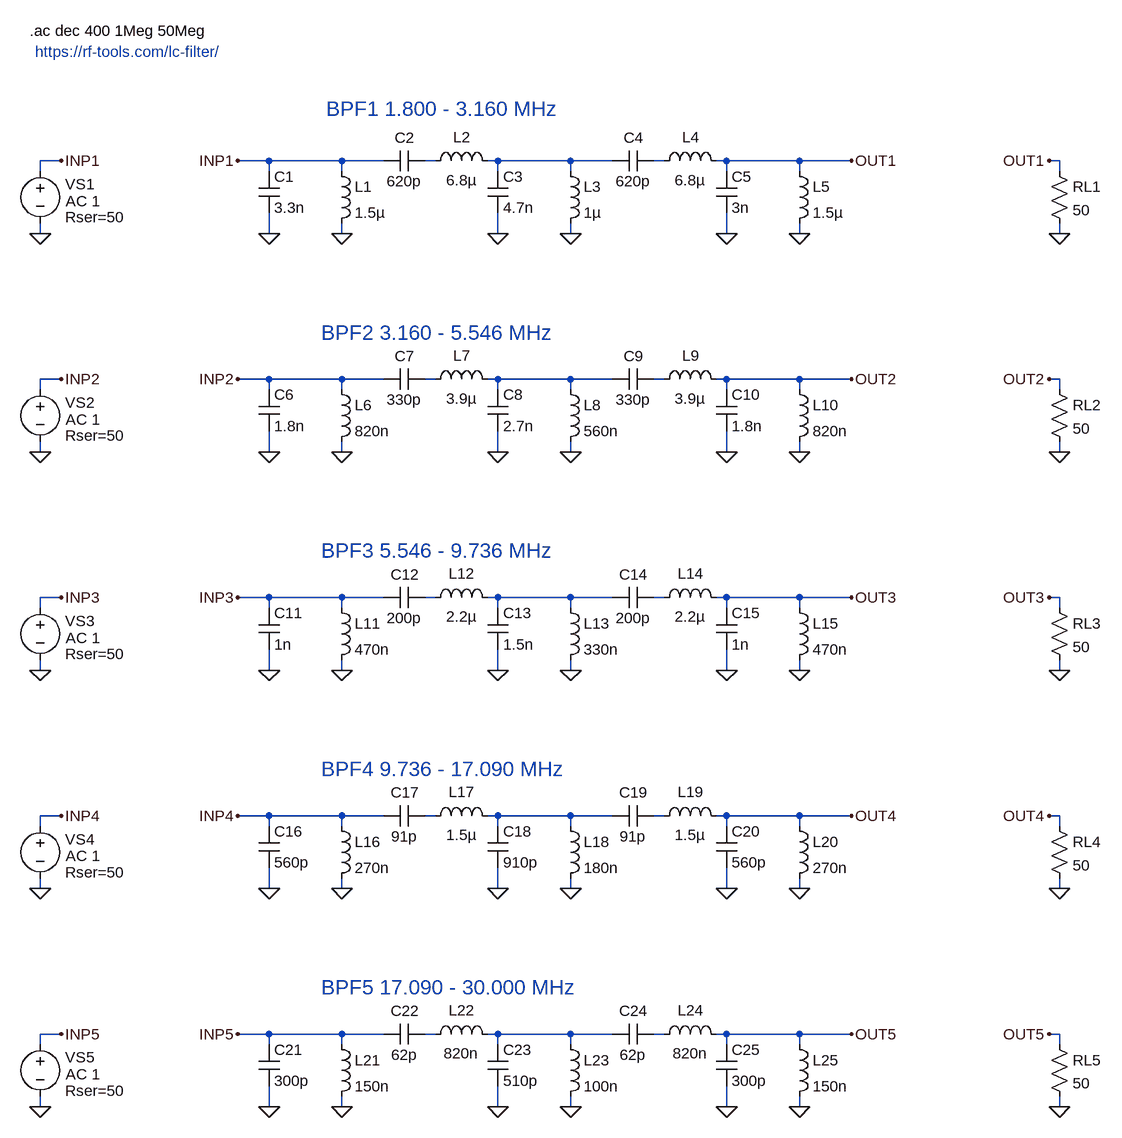
[diagram p0: schematic BPF.asc]
BPF.asc, the LTspice schematic file:
Version 4
SHEET 1 2944 2596
WIRE 16 112 -16 112
WIRE 336 112 288 112
WIRE 448 112 336 112
WIRE 512 112 448 112
WIRE 592 112 576 112
WIRE 688 112 672 112
WIRE 800 112 688 112
WIRE 864 112 800 112
WIRE 944 112 928 112
WIRE 1040 112 1024 112
WIRE 1152 112 1040 112
WIRE 1232 112 1152 112
WIRE 1552 112 1536 112
WIRE -16 128 -16 112
WIRE 336 128 336 112
WIRE 448 128 448 112
WIRE 688 128 688 112
WIRE 800 128 800 112
WIRE 1040 128 1040 112
WIRE 1152 128 1152 112
WIRE 1552 128 1552 112
WIRE -16 224 -16 208
WIRE 336 224 336 192
WIRE 448 224 448 208
WIRE 688 224 688 192
WIRE 800 224 800 208
WIRE 1040 224 1040 192
WIRE 1152 224 1152 208
WIRE 1552 224 1552 208
WIRE 16 448 -16 448
WIRE 336 448 288 448
WIRE 448 448 336 448
WIRE 512 448 448 448
WIRE 592 448 576 448
WIRE 688 448 672 448
WIRE 800 448 688 448
WIRE 864 448 800 448
WIRE 944 448 928 448
WIRE 1040 448 1024 448
WIRE 1152 448 1040 448
WIRE 1232 448 1152 448
WIRE 1552 448 1536 448
WIRE -16 464 -16 448
WIRE 336 464 336 448
WIRE 448 464 448 448
WIRE 688 464 688 448
WIRE 800 464 800 448
WIRE 1040 464 1040 448
WIRE 1152 464 1152 448
WIRE 1552 464 1552 448
WIRE -16 560 -16 544
WIRE 336 560 336 528
WIRE 448 560 448 544
WIRE 688 560 688 528
WIRE 800 560 800 544
WIRE 1040 560 1040 528
WIRE 1152 560 1152 544
WIRE 1552 560 1552 544
WIRE 16 784 -16 784
WIRE 336 784 288 784
WIRE 448 784 336 784
WIRE 512 784 448 784
WIRE 592 784 576 784
WIRE 688 784 672 784
WIRE 800 784 688 784
WIRE 864 784 800 784
WIRE 944 784 928 784
WIRE 1040 784 1024 784
WIRE 1152 784 1040 784
WIRE 1232 784 1152 784
WIRE 1552 784 1536 784
WIRE -16 800 -16 784
WIRE 336 800 336 784
WIRE 448 800 448 784
WIRE 688 800 688 784
WIRE 800 800 800 784
WIRE 1040 800 1040 784
WIRE 1152 800 1152 784
WIRE 1552 800 1552 784
WIRE -16 896 -16 880
WIRE 336 896 336 864
WIRE 448 896 448 880
WIRE 688 896 688 864
WIRE 800 896 800 880
WIRE 1040 896 1040 864
WIRE 1152 896 1152 880
WIRE 1552 896 1552 880
WIRE 16 1120 -16 1120
WIRE 336 1120 288 1120
WIRE 448 1120 336 1120
WIRE 512 1120 448 1120
WIRE 592 1120 576 1120
WIRE 688 1120 672 1120
WIRE 800 1120 688 1120
WIRE 864 1120 800 1120
WIRE 944 1120 928 1120
WIRE 1040 1120 1024 1120
WIRE 1152 1120 1040 1120
WIRE 1232 1120 1152 1120
WIRE 1552 1120 1536 1120
WIRE -16 1136 -16 1120
WIRE 336 1136 336 1120
WIRE 448 1136 448 1120
WIRE 688 1136 688 1120
WIRE 800 1136 800 1120
WIRE 1040 1136 1040 1120
WIRE 1152 1136 1152 1120
WIRE 1552 1136 1552 1120
WIRE -16 1232 -16 1216
WIRE 336 1232 336 1200
WIRE 448 1232 448 1216
WIRE 688 1232 688 1200
WIRE 800 1232 800 1216
WIRE 1040 1232 1040 1200
WIRE 1152 1232 1152 1216
WIRE 1552 1232 1552 1216
WIRE 16 1456 -16 1456
WIRE 336 1456 288 1456
WIRE 448 1456 336 1456
WIRE 512 1456 448 1456
WIRE 592 1456 576 1456
WIRE 688 1456 672 1456
WIRE 800 1456 688 1456
WIRE 864 1456 800 1456
WIRE 944 1456 928 1456
WIRE 1040 1456 1024 1456
WIRE 1152 1456 1040 1456
WIRE 1232 1456 1152 1456
WIRE 1552 1456 1536 1456
WIRE -16 1472 -16 1456
WIRE 336 1472 336 1456
WIRE 448 1472 448 1456
WIRE 688 1472 688 1456
WIRE 800 1472 800 1456
WIRE 1040 1472 1040 1456
WIRE 1152 1472 1152 1456
WIRE 1552 1472 1552 1456
WIRE -16 1568 -16 1552
WIRE 336 1568 336 1536
WIRE 448 1568 448 1552
WIRE 688 1568 688 1536
WIRE 800 1568 800 1552
WIRE 1040 1568 1040 1536
WIRE 1152 1568 1152 1552
WIRE 1552 1568 1552 1552
FLAG -16 224 0
FLAG 448 224 0
FLAG 336 224 0
FLAG 800 224 0
FLAG 688 224 0
FLAG 288 112 INP1
FLAG 16 112 INP1
FLAG 1552 224 0
FLAG 1536 112 OUT1
FLAG 1232 112 OUT1
FLAG -16 560 0
FLAG 288 448 INP2
FLAG 16 448 INP2
FLAG 1552 560 0
FLAG 1536 448 OUT2
FLAG -16 896 0
FLAG 288 784 INP3
FLAG 16 784 INP3
FLAG 1552 896 0
FLAG 1536 784 OUT3
FLAG -16 1232 0
FLAG 288 1120 INP4
FLAG 16 1120 INP4
FLAG 1552 1232 0
FLAG 1536 1120 OUT4
FLAG -16 1568 0
FLAG 288 1456 INP5
FLAG 16 1456 INP5
FLAG 1552 1568 0
FLAG 1536 1456 OUT5
FLAG 1152 224 0
FLAG 1040 224 0
FLAG 448 560 0
FLAG 336 560 0
FLAG 800 560 0
FLAG 688 560 0
FLAG 1232 448 OUT2
FLAG 1152 560 0
FLAG 1040 560 0
FLAG 448 896 0
FLAG 336 896 0
FLAG 800 896 0
FLAG 688 896 0
FLAG 1232 784 OUT3
FLAG 1152 896 0
FLAG 1040 896 0
FLAG 448 1232 0
FLAG 336 1232 0
FLAG 800 1232 0
FLAG 688 1232 0
FLAG 1232 1120 OUT4
FLAG 1152 1232 0
FLAG 1040 1232 0
FLAG 448 1568 0
FLAG 336 1568 0
FLAG 800 1568 0
FLAG 688 1568 0
FLAG 1232 1456 OUT5
FLAG 1152 1568 0
FLAG 1040 1568 0
SYMBOL voltage -16 112 R0
WINDOW 0 38 36 Left 2
WINDOW 123 39 62 Left 2
WINDOW 39 38 87 Left 2
SYMATTR InstName VS1
SYMATTR Value2 AC 1
SYMATTR SpiceLine Rser=50
SYMATTR Value ""
SYMBOL cap 320 128 R0
SYMATTR InstName C1
SYMATTR Value 3.3n
SYMBOL ind 432 112 R0
SYMATTR InstName L1
SYMATTR Value 1.5µ
SYMBOL cap 672 128 R0
SYMATTR InstName C3
SYMATTR Value 4.7n
SYMBOL ind 784 112 R0
SYMATTR InstName L3
SYMATTR Value 1µ
SYMBOL res 1536 112 R0
SYMATTR InstName RL1
SYMATTR Value 50
SYMBOL voltage -16 448 R0
WINDOW 0 38 36 Left 2
WINDOW 123 39 62 Left 2
WINDOW 39 38 87 Left 2
SYMATTR InstName VS2
SYMATTR Value2 AC 1
SYMATTR SpiceLine Rser=50
SYMATTR Value ""
SYMBOL res 1536 448 R0
SYMATTR InstName RL2
SYMATTR Value 50
SYMBOL voltage -16 784 R0
WINDOW 0 38 36 Left 2
WINDOW 123 39 62 Left 2
WINDOW 39 38 87 Left 2
SYMATTR InstName VS3
SYMATTR Value2 AC 1
SYMATTR SpiceLine Rser=50
SYMATTR Value ""
SYMBOL res 1536 784 R0
SYMATTR InstName RL3
SYMATTR Value 50
SYMBOL voltage -16 1120 R0
WINDOW 0 38 36 Left 2
WINDOW 123 39 62 Left 2
WINDOW 39 38 87 Left 2
SYMATTR InstName VS4
SYMATTR Value2 AC 1
SYMATTR SpiceLine Rser=50
SYMATTR Value ""
SYMBOL res 1536 1120 R0
SYMATTR InstName RL4
SYMATTR Value 50
SYMBOL voltage -16 1456 R0
WINDOW 0 38 36 Left 2
WINDOW 123 39 62 Left 2
WINDOW 39 38 87 Left 2
SYMATTR InstName VS5
SYMATTR Value2 AC 1
SYMATTR SpiceLine Rser=50
SYMATTR Value ""
SYMBOL res 1536 1456 R0
SYMATTR InstName RL5
SYMATTR Value 50
SYMBOL cap 928 96 R90
WINDOW 0 -4 31 VBottom 2
WINDOW 3 32 32 VTop 2
SYMATTR InstName C4
SYMATTR Value 620p
SYMBOL ind 928 128 R270
WINDOW 0 37 57 VTop 2
WINDOW 3 2 56 VBottom 2
SYMATTR InstName L4
SYMATTR Value 6.8µ
SYMBOL cap 576 96 R90
WINDOW 0 -4 31 VBottom 2
WINDOW 3 32 32 VTop 2
SYMATTR InstName C2
SYMATTR Value 620p
SYMBOL ind 576 128 R270
WINDOW 0 37 57 VTop 2
WINDOW 3 2 56 VBottom 2
SYMATTR InstName L2
SYMATTR Value 6.8µ
SYMBOL cap 1024 128 R0
SYMATTR InstName C5
SYMATTR Value 3n
SYMBOL ind 1136 112 R0
SYMATTR InstName L5
SYMATTR Value 1.5µ
SYMBOL cap 320 464 R0
SYMATTR InstName C6
SYMATTR Value 1.8n
SYMBOL ind 432 448 R0
SYMATTR InstName L6
SYMATTR Value 820n
SYMBOL cap 672 464 R0
SYMATTR InstName C8
SYMATTR Value 2.7n
SYMBOL ind 784 448 R0
SYMATTR InstName L8
SYMATTR Value 560n
SYMBOL cap 928 432 R90
WINDOW 0 -4 31 VBottom 2
WINDOW 3 32 32 VTop 2
SYMATTR InstName C9
SYMATTR Value 330p
SYMBOL ind 928 464 R270
WINDOW 0 37 57 VTop 2
WINDOW 3 2 56 VBottom 2
SYMATTR InstName L9
SYMATTR Value 3.9µ
SYMBOL cap 576 432 R90
WINDOW 0 -4 31 VBottom 2
WINDOW 3 32 32 VTop 2
SYMATTR InstName C7
SYMATTR Value 330p
SYMBOL ind 576 464 R270
WINDOW 0 37 57 VTop 2
WINDOW 3 2 56 VBottom 2
SYMATTR InstName L7
SYMATTR Value 3.9µ
SYMBOL cap 1024 464 R0
SYMATTR InstName C10
SYMATTR Value 1.8n
SYMBOL ind 1136 448 R0
SYMATTR InstName L10
SYMATTR Value 820n
SYMBOL cap 320 800 R0
SYMATTR InstName C11
SYMATTR Value 1n
SYMBOL ind 432 784 R0
SYMATTR InstName L11
SYMATTR Value 470n
SYMBOL cap 672 800 R0
SYMATTR InstName C13
SYMATTR Value 1.5n
SYMBOL ind 784 784 R0
SYMATTR InstName L13
SYMATTR Value 330n
SYMBOL cap 928 768 R90
WINDOW 0 -4 31 VBottom 2
WINDOW 3 32 32 VTop 2
SYMATTR InstName C14
SYMATTR Value 200p
SYMBOL ind 928 800 R270
WINDOW 0 37 57 VTop 2
WINDOW 3 2 56 VBottom 2
SYMATTR InstName L14
SYMATTR Value 2.2µ
SYMBOL cap 576 768 R90
WINDOW 0 -4 31 VBottom 2
WINDOW 3 32 32 VTop 2
SYMATTR InstName C12
SYMATTR Value 200p
SYMBOL ind 576 800 R270
WINDOW 0 37 57 VTop 2
WINDOW 3 2 56 VBottom 2
SYMATTR InstName L12
SYMATTR Value 2.2µ
SYMBOL cap 1024 800 R0
SYMATTR InstName C15
SYMATTR Value 1n
SYMBOL ind 1136 784 R0
SYMATTR InstName L15
SYMATTR Value 470n
SYMBOL cap 320 1136 R0
SYMATTR InstName C16
SYMATTR Value 560p
SYMBOL ind 432 1120 R0
SYMATTR InstName L16
SYMATTR Value 270n
SYMBOL cap 672 1136 R0
SYMATTR InstName C18
SYMATTR Value 910p
SYMBOL ind 784 1120 R0
SYMATTR InstName L18
SYMATTR Value 180n
SYMBOL cap 928 1104 R90
WINDOW 0 -4 31 VBottom 2
WINDOW 3 32 32 VTop 2
SYMATTR InstName C19
SYMATTR Value 91p
SYMBOL ind 928 1136 R270
WINDOW 0 37 57 VTop 2
WINDOW 3 2 56 VBottom 2
SYMATTR InstName L19
SYMATTR Value 1.5µ
SYMBOL cap 576 1104 R90
WINDOW 0 -4 31 VBottom 2
WINDOW 3 32 32 VTop 2
SYMATTR InstName C17
SYMATTR Value 91p
SYMBOL ind 576 1136 R270
WINDOW 0 37 57 VTop 2
WINDOW 3 2 56 VBottom 2
SYMATTR InstName L17
SYMATTR Value 1.5µ
SYMBOL cap 1024 1136 R0
SYMATTR InstName C20
SYMATTR Value 560p
SYMBOL ind 1136 1120 R0
SYMATTR InstName L20
SYMATTR Value 270n
SYMBOL cap 320 1472 R0
SYMATTR InstName C21
SYMATTR Value 300p
SYMBOL ind 432 1456 R0
SYMATTR InstName L21
SYMATTR Value 150n
SYMBOL cap 672 1472 R0
SYMATTR InstName C23
SYMATTR Value 510p
SYMBOL ind 784 1456 R0
SYMATTR InstName L23
SYMATTR Value 100n
SYMBOL cap 928 1440 R90
WINDOW 0 -4 31 VBottom 2
WINDOW 3 32 32 VTop 2
SYMATTR InstName C24
SYMATTR Value 62p
SYMBOL ind 928 1472 R270
WINDOW 0 37 57 VTop 2
WINDOW 3 2 56 VBottom 2
SYMATTR InstName L24
SYMATTR Value 820n
SYMBOL cap 576 1440 R90
WINDOW 0 -4 31 VBottom 2
WINDOW 3 32 32 VTop 2
SYMATTR InstName C22
SYMATTR Value 62p
SYMBOL ind 576 1472 R270
WINDOW 0 37 57 VTop 2
WINDOW 3 2 56 VBottom 2
SYMATTR InstName L22
SYMATTR Value 820n
SYMBOL cap 1024 1472 R0
SYMATTR InstName C25
SYMATTR Value 300p
SYMBOL ind 1136 1456 R0
SYMATTR InstName L25
SYMATTR Value 150n
TEXT 424 32 Left 3 ;BPF1 1.800 - 3.160 MHz
TEXT -32 -88 Left 2 !.ac dec 400 1Meg 50Meg
TEXT 416 376 Left 3 ;BPF2 3.160 - 5.546 MHz
TEXT 416 712 Left 3 ;BPF3 5.546 - 9.736 MHz
TEXT 416 1048 Left 3 ;BPF4 9.736 - 17.090 MHz
TEXT 416 1384 Left 3 ;BPF5 17.090 - 30.000 MHz
TEXT -24 -56 Left 2 ;https://rf-tools.com/lc-filter/
LINE Normal 576 32 576 32 2
LINE Normal 576 32 576 32 2

The netlist it stands for:
* BPF.asc
VS1 INP1 0 AC 1 Rser=50
C1 INP1 0 3.3n
L1 INP1 0 1.5µ
C3 N002 0 4.7n
L3 N002 0 1µ
RL1 OUT1 0 50
VS2 INP2 0 AC 1 Rser=50
RL2 OUT2 0 50
VS3 INP3 0 AC 1 Rser=50
RL3 OUT3 0 50
VS4 INP4 0 AC 1 Rser=50
RL4 OUT4 0 50
VS5 INP5 0 AC 1 Rser=50
RL5 OUT5 0 50
C4 N003 N002 620p
L4 N003 OUT1 6.8µ
C2 N001 INP1 620p
L2 N001 N002 6.8µ
C5 OUT1 0 3n
L5 OUT1 0 1.5µ
C6 INP2 0 1.8n
L6 INP2 0 820n
C8 N005 0 2.7n
L8 N005 0 560n
C9 N006 N005 330p
L9 N006 OUT2 3.9µ
C7 N004 INP2 330p
L7 N004 N005 3.9µ
C10 OUT2 0 1.8n
L10 OUT2 0 820n
C11 INP3 0 1n
L11 INP3 0 470n
C13 N008 0 1.5n
L13 N008 0 330n
C14 N009 N008 200p
L14 N009 OUT3 2.2µ
C12 N007 INP3 200p
L12 N007 N008 2.2µ
C15 OUT3 0 1n
L15 OUT3 0 470n
C16 INP4 0 560p
L16 INP4 0 270n
C18 N011 0 910p
L18 N011 0 180n
C19 N012 N011 91p
L19 N012 OUT4 1.5µ
C17 N010 INP4 91p
L17 N010 N011 1.5µ
C20 OUT4 0 560p
L20 OUT4 0 270n
C21 INP5 0 300p
L21 INP5 0 150n
C23 N014 0 510p
L23 N014 0 100n
C24 N015 N014 62p
L24 N015 OUT5 820n
C22 N013 INP5 62p
L22 N013 N014 820n
C25 OUT5 0 300p
L25 OUT5 0 150n
* BPF1 1.800 - 3.160 MHz
.ac dec 400 1Meg 50Meg
* BPF2 3.160 - 5.546 MHz
* BPF3 5.546 - 9.736 MHz
* BPF4 9.736 - 17.090 MHz
* BPF5 17.090 - 30.000 MHz
* https://rf-tools.com/lc-filter/
.backanno
.end